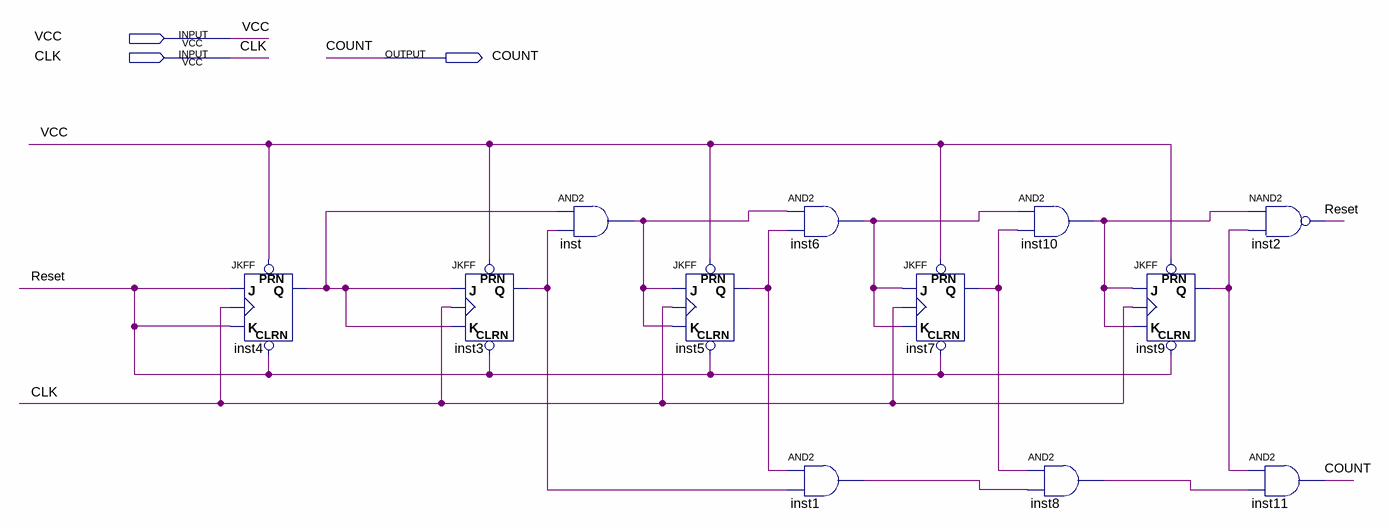
[diagram p0: schematic sheet]
// Quartus schematic Reloj30.bdf as structural Verilog: 12 symbols, 3 pins
module Reloj30 (
  input  VCC,
  input  CLK,
  output COUNT
);

  wire inst1_out, inst3_q, inst4_q, inst5_q, inst6_out, inst7_q, inst8_out, inst9_q, inst10_out, inst_out,
       Reset;

  JKFF inst4 (.PRN(VCC), .CLRN(Reset), .K(Reset), .J(Reset), .CLK(CLK), .Q(inst4_q));
  JKFF inst3 (.PRN(VCC), .CLRN(Reset), .K(inst4_q), .J(inst4_q), .CLK(CLK), .Q(inst3_q));
  and inst (inst_out, inst4_q, inst3_q);
  JKFF inst5 (.PRN(VCC), .CLRN(Reset), .K(inst_out), .J(inst_out), .CLK(CLK), .Q(inst5_q));
  and inst6 (inst6_out, inst_out, inst5_q);
  and inst1 (inst1_out, inst5_q, inst3_q);
  JKFF inst7 (.PRN(VCC), .CLRN(Reset), .K(inst6_out), .J(inst6_out), .CLK(CLK), .Q(inst7_q));
  and inst10 (inst10_out, inst6_out, inst7_q);
  and inst8 (inst8_out, inst7_q, inst1_out);
  JKFF inst9 (.PRN(VCC), .CLRN(Reset), .K(inst10_out), .J(inst10_out), .CLK(CLK), .Q(inst9_q));
  nand inst2 (Reset, inst10_out, inst9_q);
  and inst11 (COUNT, inst9_q, inst8_out);
endmodule
